# Altium schematic sheet FingerprintLock.schdoc
size 298 x 429 mm
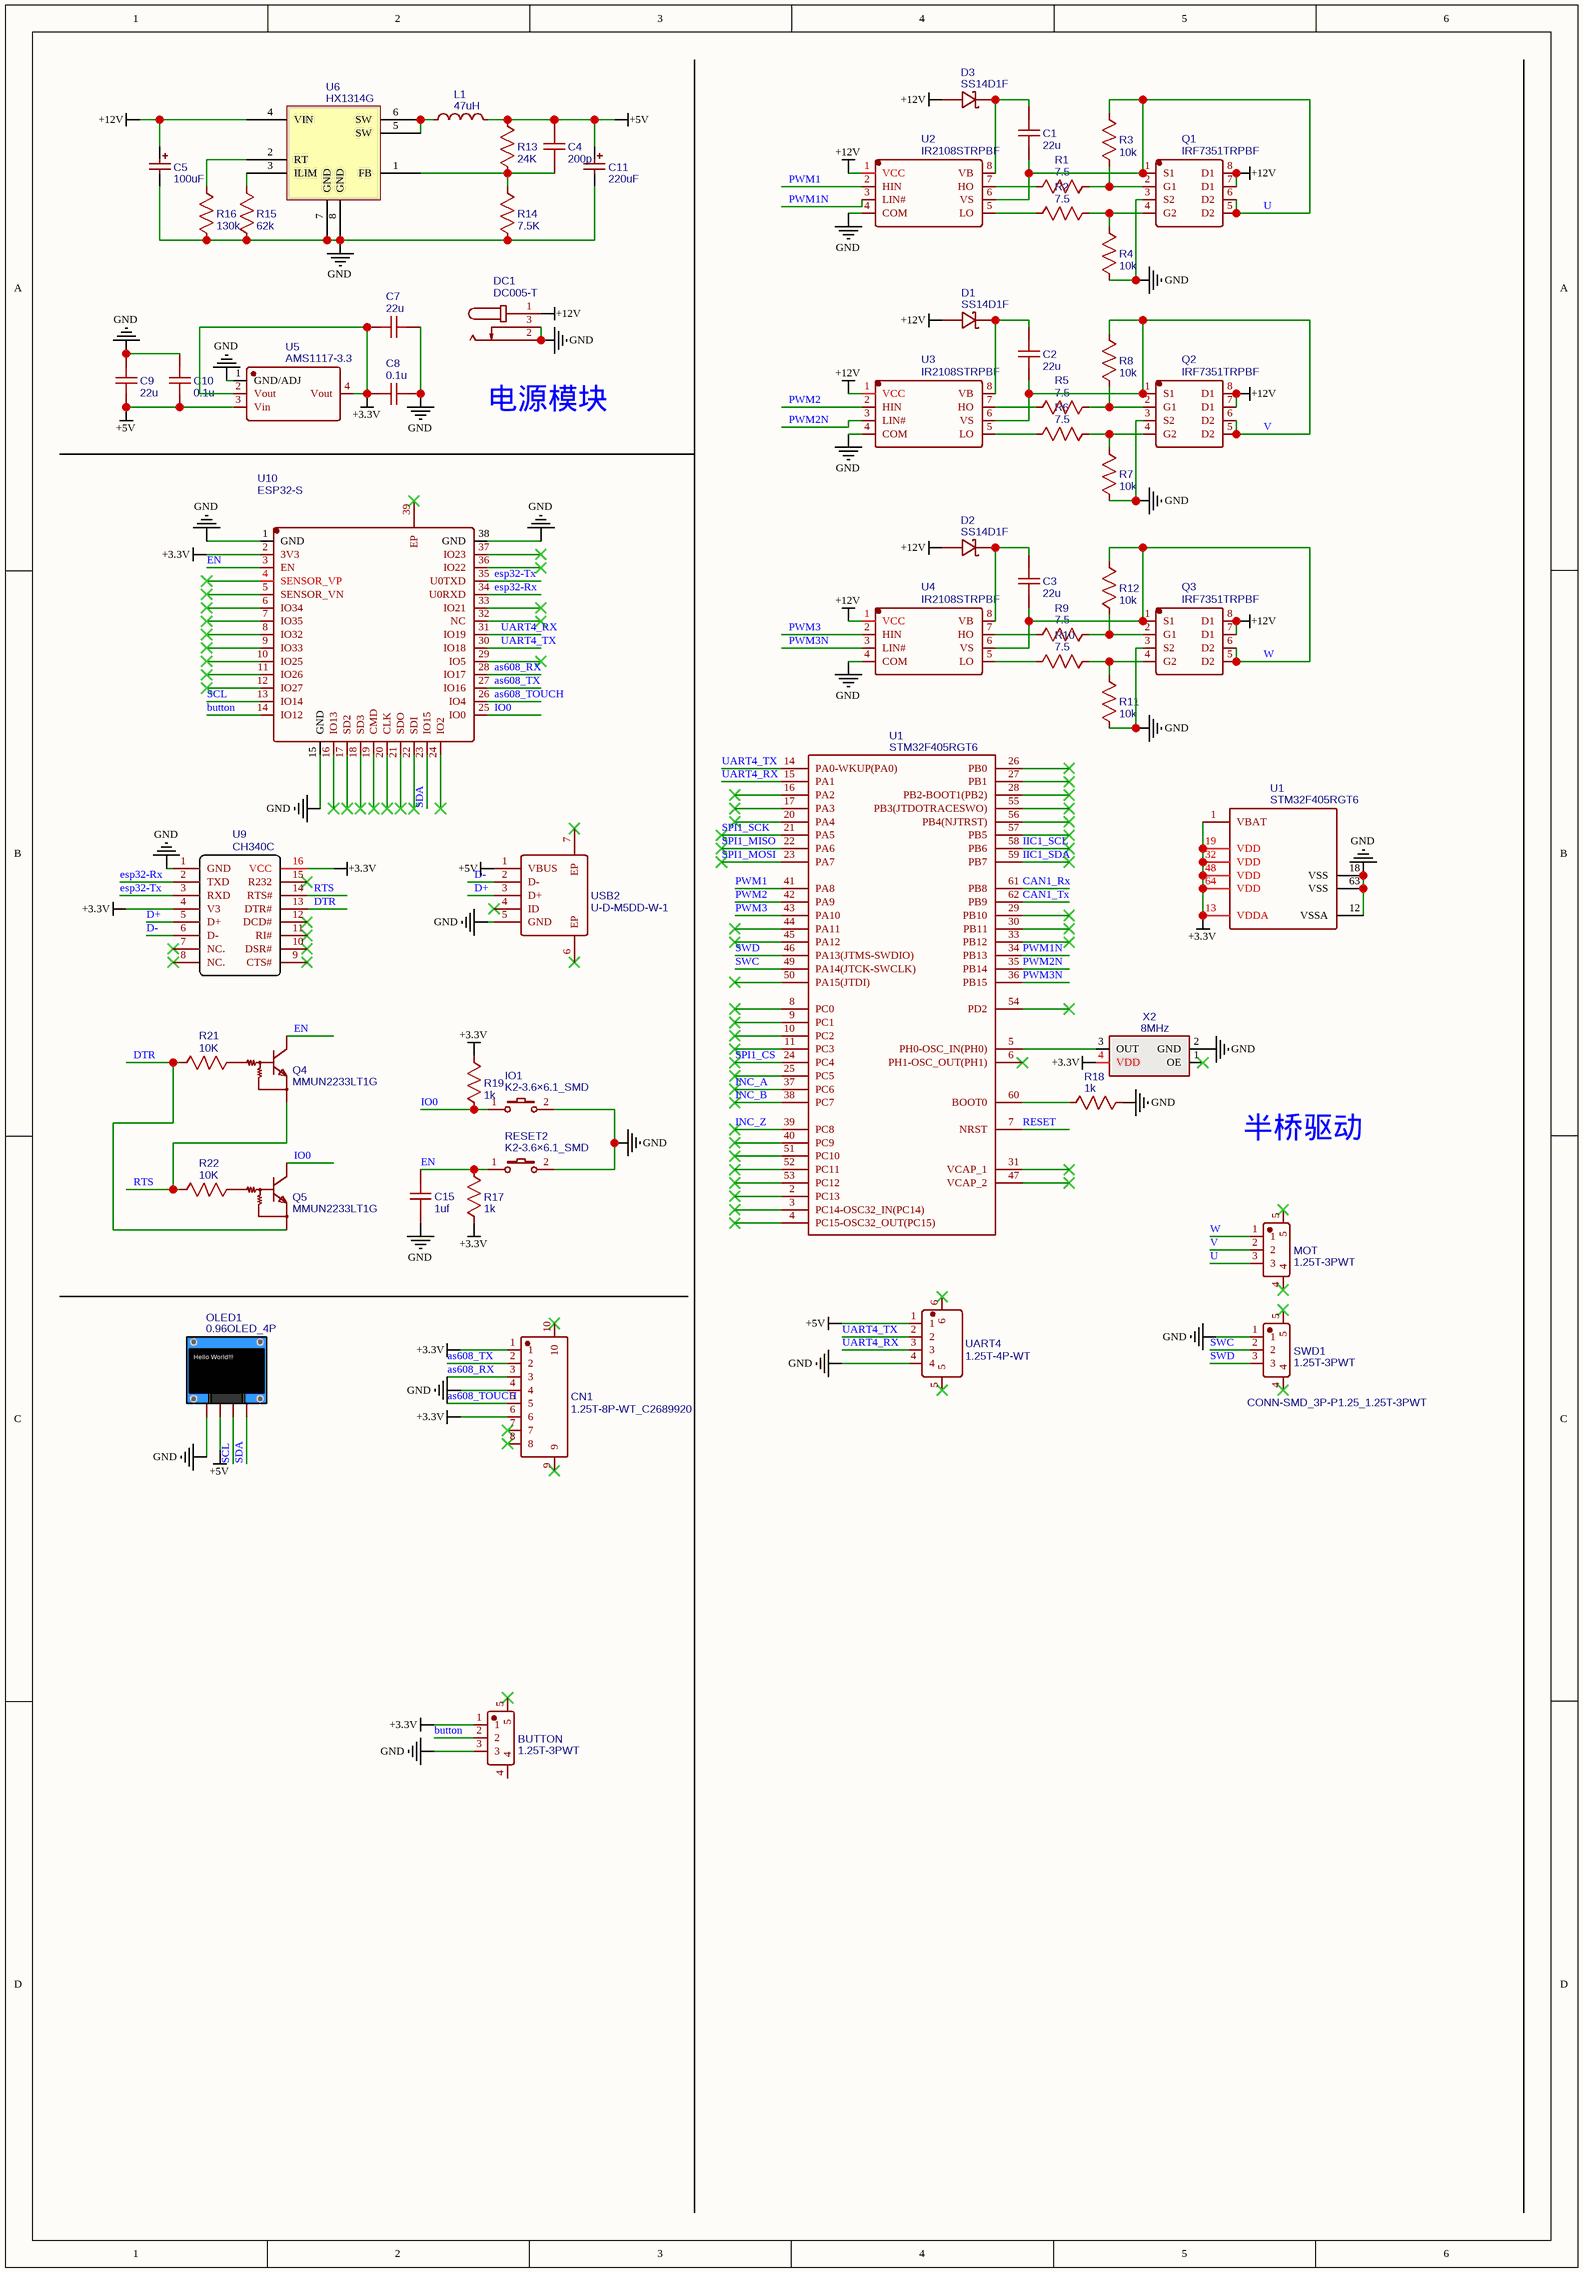
[diagram p0: FingerprintLock.schdoc]

## Parts
(Parts that share a designator on the sheet are numbered #1, #2 ... from top to bottom, then left to right.)
BUTTON  1.25T-3PWT  [CONN-SMD_3P-P1.25_1.25T-3PWT]
C1  22u  [C0603]
C2  22u  [C0603]
C3  22u  [C0603]
C4  200p  [C0603]
C5  100uF  [CAP-SMD_L3.5-W2.8-R-RD]
C7  22u  [C0603]
C8  0.1u  [C0603]
C9  22u  [C0603]
C10  0.1u  [C0603]
C11  220uF  [CAP-SMD_L3.5-W2.8-R-RD]
C15  1uf  [C0603]
CN1  1.25T-8P-WT_C2689920  [CONN-SMD_1.25T-8P-WT_C2689920]
D1  SS14D1F  [SOD-123_L2.8-W1.8-LS3.7-RD]
D2  SS14D1F  [SOD-123_L2.8-W1.8-LS3.7-RD]
D3  SS14D1F  [SOD-123_L2.8-W1.8-LS3.7-RD]
DC1  DC005-T  [DC-IN-TH_DC005-T]
IO1  K2-3.6×6.1_SMD  [KEY-SMD_2P-L6.2-W3.6-LS8.0]
L1  47uH  [IND-SMD_L6.7-W6.7]
MOT  1.25T-3PWT  [CONN-SMD_3P-P1.25_1.25T-3PWT]
OLED1  0.96OLED_4P  [0.96OLED_4P]
Q1  IRF7351TRPBF  [SOIC-8_L4.9-W3.9-P1.27-LS6.0-BL]
Q2  IRF7351TRPBF  [SOIC-8_L4.9-W3.9-P1.27-LS6.0-BL]
Q3  IRF7351TRPBF  [SOIC-8_L4.9-W3.9-P1.27-LS6.0-BL]
Q4  MMUN2233LT1G  [SOT-23-3_L2.9-W1.3-P1.90-LS2.4-BR]
Q5  MMUN2233LT1G  [SOT-23-3_L2.9-W1.3-P1.90-LS2.4-BR]
R1  7.5  [R0603]
R2  7.5  [R0603]
R3  10k  [R0603]
R4  10k  [R0603]
R5  7.5  [R0603]
R6  7.5  [R0603]
R7  10k  [R0603]
R8  10k  [R0603]
R9  7.5  [R0603]
R10  7.5  [R0603]
R11  10k  [R0603]
R12  10k  [R0603]
R13  24K  [R0603]
R14  7.5K  [R0603]
R15  62k  [R0603]
R16  130k  [R0603]
R17  1k  [R0603]
R18  1k  [R0603]
R19  1k  [R0603]
R21  10K  [R0603]
R22  10K  [R0603]
RESET2  K2-3.6×6.1_SMD  [KEY-SMD_2P-L6.2-W3.6-LS8.0]
SWD1  1.25T-3PWT  [CONN-SMD_3P-P1.25_1.25T-3PWT]
U1#1  STM32F405RGT6  [LQFP-64_L10.0-W10.0-P0.50-LS12.0-BL]
U1#2  STM32F405RGT6  [LQFP-64_L10.0-W10.0-P0.50-LS12.0-BL]
U2  IR2108STRPBF  [SOIC-8_L4.9-W3.9-P1.27-LS6.0-BL]
U3  IR2108STRPBF  [SOIC-8_L4.9-W3.9-P1.27-LS6.0-BL]
U4  IR2108STRPBF  [SOIC-8_L4.9-W3.9-P1.27-LS6.0-BL]
U5  AMS1117-3.3  [SOT-223-3_L6.5-W3.4-P2.30-LS7.0-BR]
U6  HX1314G  [SOP8]
U9  CH340C  [SOP-16_L10.0-W3.9-P1.27-LS6.0-BL]
U10  ESP32-S  [WIRELM-SMD_ESP32-S]
UART4  1.25T-4P-WT  [CONN-SMD_4P-1.25P_1.25T-4P]
USB2  U-D-M5DD-W-1  [MICRO-USB-TH_MICRO-USB-A14]
X2  8MHz  [OSC-SMD_4P-L3.2-W2.5-BL]

## Nets
+3.3V: BUTTON.1 C7.1 C8.1 CN1.1 CN1.6 R17.1 R19.2 U1#1.1(VBAT) U1#1.13(VDDA) U1#1.19(VDD) U1#1.32(VDD) U1#1.48(VDD) U1#1.64(VDD) U5.2(Vout) U5.4(Vout) U9.4(V3) U9.16(VCC) U10.2(3V3) X2.4(VDD)
+5V: C4.2 C9.1 C10.1 C11.1 L1.2 OLED1.2 R13.2 U5.3(Vin) UART4.1 USB2.1(VBUS)
+12V: C5.1 D1.2 D2.2 D3.2 DC1.1 Q1.7(D1) Q1.8(D1) Q2.7(D1) Q2.8(D1) Q3.7(D1) Q3.8(D1) U2.1(VCC) U3.1(VCC) U4.1(VCC) U6.4(VIN)
GND: BUTTON.3 C5.2 C7.2 C8.2 C9.2 C10.2 C11.2 C15.1 CN1.4 DC1.2 DC1.3 IO1.2 OLED1.1 Q1.3(S2) Q2.3(S2) Q3.3(S2) R4.1 R7.1 R11.1 R14.1 R15.1 R16.1 R18.1 RESET2.2 SWD1.1 U1#1.12(VSSA) U1#1.18(VSS) U1#1.63(VSS) U2.4(COM) U3.4(COM) U4.4(COM) U5.1(GND/ADJ) U6.7(GND) U6.8(GND) U9.1(GND) U10.1(GND) U10.15(GND) U10.38(GND) UART4.4 USB2.5(GND) X2.2(GND)
as608_RX: CN1.3 U10.28(IO17)
as608_TOUCH: CN1.5 U10.26(IO4)
as608_TX: CN1.2 U10.27(IO16)
button: BUTTON.2 U10.14(IO12)
CAN1_Rx: U1#2.61(PB8)
CAN1_Tx: U1#2.62(PB9)
D+: U9.5(D+) USB2.3(D+)
D-: U9.6(D-) USB2.2(D-)
DTR: Q5.2(E) R21.1 U9.13(DTR#)
EN: C15.2 Q4.3(C) R17.2 RESET2.1 U10.3(EN)
esp32-Rx: U9.2(TXD) U10.34(U0RXD)
esp32-Tx: U9.3(RXD) U10.35(U0TXD)
IIC1_SCL: U1#2.58(PB6)
IIC1_SDA: U1#2.59(PB7)
INC_A: U1#2.37(PC6)
INC_B: U1#2.38(PC7)
INC_Z: U1#2.39(PC8)
IO0: IO1.1 Q5.3(C) R19.1 U10.25(IO0)
PWM1: U1#2.41(PA8) U2.2(HIN)
PWM1N: U1#2.34(PB13) U2.3(LIN#)
PWM2: U1#2.42(PA9) U3.2(HIN)
PWM2N: U1#2.35(PB14) U3.3(LIN#)
PWM3: U1#2.43(PA10) U4.2(HIN)
PWM3N: U1#2.36(PB15) U4.3(LIN#)
RESET: U1#2.7(NRST)
RTS: Q4.2(E) R22.1 U9.14(RTS#)
SCL: OLED1.3 U10.13(IO14)
SDA: OLED1.4 U10.23(IO15)
SPI1_CS: U1#2.24(PC4)
SPI1_MISO: U1#2.22(PA6)
SPI1_MOSI: U1#2.23(PA7)
SPI1_SCK: U1#2.21(PA5)
SWC: SWD1.2 U1#2.49(PA14(JTCK-SWCLK))
SWD: SWD1.3 U1#2.46(PA13(JTMS-SWDIO))
U: C1.1 MOT.3 Q1.1(S1) Q1.5(D2) Q1.6(D2) R3.2 U2.6(VS)
UART4_RX: U1#2.15(PA1) U10.31(IO19) UART4.3
UART4_TX: U1#2.14(PA0-WKUP(PA0)) U10.30(IO18) UART4.2
V: C2.1 MOT.2 Q2.1(S1) Q2.5(D2) Q2.6(D2) R8.2 U3.6(VS)
W: C3.1 MOT.1 Q3.1(S1) Q3.5(D2) Q3.6(D2) R12.2 U4.6(VS)
NetC1_2: C1.2 D3.1 U2.8(VB)
NetC2_2: C2.2 D1.1 U3.8(VB)
NetC3_2: C3.2 D2.1 U4.8(VB)
NetC4_1: C4.1 R13.1 R14.2 U6.1(FB)
NetL1_1: L1.1 U6.5(SW) U6.6(SW)
NetQ1_2: Q1.2(G1) R1.2 R3.1
NetQ1_4: Q1.4(G2) R2.2 R4.2
NetQ2_2: Q2.2(G1) R5.2 R8.1
NetQ2_4: Q2.4(G2) R6.2 R7.2
NetQ3_2: Q3.2(G1) R9.2 R12.1
NetQ3_4: Q3.4(G2) R10.2 R11.2
NetQ4_1: Q4.1(B) R21.2
NetQ5_1: Q5.1(B) R22.2
NetR1_1: R1.1 U2.7(HO)
NetR2_1: R2.1 U2.5(LO)
NetR5_1: R5.1 U3.7(HO)
NetR6_1: R6.1 U3.5(LO)
NetR9_1: R9.1 U4.7(HO)
NetR10_1: R10.1 U4.5(LO)
NetR15_2: R15.2 U6.3(ILIM)
NetR16_2: R16.2 U6.2(RT)
NetR18_2: R18.2 U1#2.60(BOOT0)
NetU1#2_5: U1#2.5(PH0-OSC_IN(PH0)) X2.3(OUT)

Not connected (* = marked no-connect by the designer): BUTTON 4 5*; CN1 7* 8* 9* 10*; MOT 4* 5*; SWD1 4* 5*; U1#2 2(PC13)* 3(PC14-OSC32_IN(PC14))* 4(PC15-OSC32_OUT(PC15))* 6(PH1-OSC_OUT(PH1))* 8(PC0)* 9(PC1)* 10(PC2)* 11(PC3)* 16(PA2)* 17(PA3)* 20(PA4)* 25(PC5)* 26(PB0)* 27(PB1)* 28(PB2-BOOT1(PB2))* 29(PB10)* 30(PB11)* 31(VCAP_1)* 33(PB12)* 40(PC9)* 44(PA11)* 45(PA12)* 47(VCAP_2)* 50(PA15(JTDI))* 51(PC10)* 52(PC11)* 53(PC12)* 54(PD2)* 55(PB3(JTDOTRACESWO))* 56(PB4(NJTRST))* 57(PB5)*; U9 7(NC.)* 8(NC.)* 9(CTS#)* 10(DSR#)* 11(RI#)* 12(DCD#)* 15(R232)*; U10 4(SENSOR_VP)* 5(SENSOR_VN)* 6(IO34)* 7(IO35)* 8(IO32)* 9(IO33)* 10(IO25)* 11(IO26)* 12(IO27)* 16(IO13)* 17(SD2)* 18(SD3)* 19(CMD)* 20(CLK)* 21(SDO)* 22(SDI)* 24(IO2)* 29(IO5)* 32(NC)* 33(IO21)* 36(IO22)* 37(IO23)* 39(EP)*; UART4 5* 6*; USB2 4(ID)* 6(EP)* 7(EP)*; X2 1(OE)*

## Notes on the sheet
- (near DC1) 电源模块
- 半桥驱动
- (in symbol 0.96OLED_4P) Hello World!!!
- (in symbol 1.25T-3PWT) CONN-SMD_3P-P1.25_1.25T-3PWT

## Library data of the parts
BUTTON MOT = 1.25T-3PWT: BOM_Manufacturer: BOOMELE; spicePre: X; BOM_Supplier: LCSC; BOM_Manufacturer Part: 1.25T-3PWT; BOM_Supplier Part: C22075; BOM_JLCPCB Part Class: Extended Part; spiceSymbolName: 1.25T-3PWT
C1-C3 C7 C9 = 22u: nameAlias: Value(F); Contributor: LCEDA_Lib; spicePre: C; spiceSymbolName: C_0603_US
C4 = 200p: nameAlias: Value(F); Contributor: LCEDA_Lib; spicePre: C; spiceSymbolName: C_0603_US
C5 = 100uF: BOM_Manufacturer: Xiangyee; BOM_Manufacturer Part: CA45-B016K106T; nameAlias: Capacitance; BOM_Supplier: LCSC; BOM_Supplier Part: C123255; BOM_JLCPCB Part Class: Extended Part; spicePre: C; spiceSymbolName: CA45-B016K106T
C8 C10 = 0.1u: nameAlias: Value(F); Contributor: LCEDA_Lib; spicePre: C; spiceSymbolName: C_0603_US
C11 = 220uF: BOM_Manufacturer: Xiangyee; BOM_Manufacturer Part: CA45-B016K106T; nameAlias: Capacitance; BOM_Supplier: LCSC; BOM_Supplier Part: C123255; BOM_JLCPCB Part Class: Extended Part; spicePre: C; spiceSymbolName: CA45-B016K106T
C15 = 1uf: nameAlias: Value(F); Contributor: LCEDA_Lib; spicePre: C; spiceSymbolName: C_0603_US
CN1 = 1.25T-8P-WT_C2689920: BOM_Manufacturer: 韩国韩荣; Contributor: huyanghong; BOM_Supplier: LCSC; BOM_Supplier Part: C2689920; BOM_Manufacturer Part: 1.25T-8P-WT; BOM_JLCPCB Part Class: Extended Part; spicePre: C; spiceSymbolName: 1.25T-8P-WT_C2689920
D1-D3 = SS14D1F: BOM_Manufacturer: PN SILICON; Contributor: LCSC; BOM_Supplier: LCSC; BOM_Supplier Part: C555467; BOM_Manufacturer Part: SS14D1F; BOM_JLCPCB Part Class: Extended Part; spicePre: D; spiceSymbolName: SS14D1F
DC1 = DC005-T: BOM_Manufacturer: SHOU HAN; Contributor: LCSC; BOM_Supplier: LCSC; BOM_Supplier Part: C431532; BOM_Manufacturer Part: DC005-T; BOM_JLCPCB Part Class: Extended Part; spicePre: D; spiceSymbolName: DC005-T
IO1 RESET2 = K2-3.6×6.1_SMD: BOM_Manufacturer Part: K2-1107ST-A4SW-06; Contributor: LCEDA_Lib; 制造商: 韩国韩荣; BOM_Supplier Part: C118141; BOM_Supplier: LCSC; spicePre: K; spiceSymbolName: K2-3.6×6.1_SMD
L1 = 47uH: BOM_Manufacturer: Sumida; BOM_Manufacturer Part: CDRH6D18HPNP-101PC; nameAlias: Inductance; Contributor: LCSC; BOM_Supplier: LCSC; BOM_Supplier Part: C212274; BOM_JLCPCB Part Class: Extended Part; spicePre: L; spiceSymbolName: CDRH6D18HPNP-101PC
OLED1 = 0.96OLED_4P: Contributor: LCEDA_Lib; BOM_Supplier: LCSC; spicePre: O; spiceSymbolName: 0.96OLED_4P
Q1-Q3 = IRF7351TRPBF: BOM_Manufacturer: Infineon Technologies; Contributor: LCSC; BOM_Supplier: LCSC; BOM_Supplier Part: C68403; BOM_Manufacturer Part: IRF7351TRPBF; BOM_JLCPCB Part Class: Extended Part; spicePre: Q; spiceSymbolName: IRF7351TRPBF
Q4 Q5 = MMUN2233LT1G: BOM_Manufacturer: ON; BOM_Supplier: LCSC; BOM_Manufacturer Part: MMUN2233LT1G; BOM_Supplier Part: C86932; BOM_JLCPCB Part Class: Extended Part; spicePre: Q; spiceSymbolName: MMUN2233LT1G
R1 R2 R5 R6 R9 R10 = 7.5: nameAlias: Value(Ω); Contributor: LCEDA_Lib; spicePre: R; spiceSymbolName: R_0603_US
R3 R4 R7 R8 R11 R12 = 10k: nameAlias: Value(Ω); Contributor: LCEDA_Lib; spicePre: R; spiceSymbolName: R_0603_US
R13 = 24K: nameAlias: Value(Ω); Contributor: LCEDA_Lib; spicePre: R; spiceSymbolName: R_0603_US
R14 = 7.5K: nameAlias: Value(Ω); Contributor: LCEDA_Lib; spicePre: R; spiceSymbolName: R_0603_US
R15 = 62k: nameAlias: Value(Ω); Contributor: LCEDA_Lib; spicePre: R; spiceSymbolName: R_0603_US
R16 = 130k: nameAlias: Value(Ω); Contributor: LCEDA_Lib; spicePre: R; spiceSymbolName: R_0603_US
R17-R19 = 1k: nameAlias: Value(Ω); Contributor: LCEDA_Lib; spicePre: R; spiceSymbolName: R_0603_US
R21 R22 = 10K: nameAlias: Value(Ω); Contributor: LCEDA_Lib; spicePre: R; spiceSymbolName: R_0603_US
SWD1 = 1.25T-3PWT: BOM_Manufacturer: BOOMELE; Package Display: Yes; spicePre: X; BOM_Supplier: LCSC; BOM_Manufacturer Part: 1.25T-3PWT; BOM_Supplier Part: C22075; BOM_JLCPCB Part Class: Extended Part; spiceSymbolName: 1.25T-3PWT
U1#1 U1#2 = STM32F405RGT6: BOM_Manufacturer: ST; subpart_no: 1; tags: STM32; BOM_Supplier Part: C15742; BOM_Supplier: LCSC; BOM_Manufacturer Part: STM32F405RGT6; image: http://image.lceda.cn/szlcsc/C15742.jpg; BOM_JLCPCB Part Class: Extended Part; spicePre: U; spiceSymbolName: STM32F405RGT6
U2-U4 = IR2108STRPBF: BOM_Manufacturer: Infineon; spicePre: X; BOM_Supplier: LCSC; BOM_Manufacturer Part: IR2108STRPBF; BOM_Supplier Part: C2964; BOM_JLCPCB Part Class: Extended Part; spiceSymbolName: IR2108STRPBF
U5 = AMS1117-3.3: BOM_Manufacturer: AMS; sourceId: dwIGgezVh; timeStamp: 1476261164; BOM_Supplier: LCSC; BOM_Manufacturer Part: AMS1117-3.3; BOM_Supplier Part: C6186; BOM_JLCPCB Part Class: Basic Part; spicePre: U; spiceSymbolName: AMS1117-3.3
U6 = HX1314G: Contributor: lzhfz_0591; spicePre: U; spiceSymbolName: HX1314G
U9 = CH340C: BOM_Manufacturer: WCH; BOM_Supplier: LCSC; BOM_Manufacturer Part: CH340C; BOM_Supplier Part: C84681; BOM_JLCPCB Part Class: Extended Part; spicePre: U; spiceSymbolName: CH340C
U10 = ESP32-S: BOM_Manufacturer: Ai-Thinker; Contributor: LCSC; BOM_Supplier: LCSC; BOM_Supplier Part: C277944; BOM_Manufacturer Part: ESP32-S; BOM_JLCPCB Part Class: Extended Part; spicePre: U; spiceSymbolName: ESP32-S
UART4 = 1.25T-4P-WT: BOM_Manufacturer: HRO; Contributor: LCSC; BOM_Supplier: LCSC; BOM_Manufacturer Part: 1.25T-4P-WT; BOM_Supplier Part: C125739; BOM_JLCPCB Part Class: Extended Part; spicePre: C; spiceSymbolName: 1.25T-4P-WT
USB2 = U-D-M5DD-W-1: BOM_Manufacturer: HRO; Contributor: LCSC; BOM_Supplier: LCSC; BOM_Manufacturer Part: U-D-M5DD-W-1; BOM_Supplier Part: C145795; BOM_JLCPCB Part Class: Extended Part; spicePre: U; spiceSymbolName: U-D-M5DD-W-1
X2 = 8MHz: BOM_Manufacturer: YXC; BOM_Manufacturer Part: O32253579545MHEA4SI-1; nameAlias: Frequency; BOM_Supplier: LCSC; BOM_Supplier Part: C70606; BOM_JLCPCB Part Class: Extended Part; spicePre: X; spiceSymbolName: O32253579545MHEA4SI-1